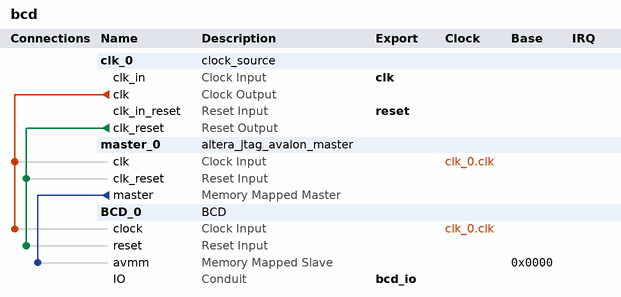
[diagram p0: system contents]
# Platform Designer (Qsys) system bcd, Cyclone II EP2C8Q208C8
# Parameters at their usual value, and those the tool derives, are not listed.
package require -exact qsys 13.0
create_system bcd
set_project_property DEVICE_FAMILY {Cyclone II}
set_project_property DEVICE EP2C8Q208C8

add_instance clk_0 clock_source 13.0
set_instance_parameter_value clk_0 clockFrequency 50000000

add_instance master_0 altera_jtag_avalon_master 13.0

add_instance BCD_0 BCD 1.0

# connections
add_connection clk_0.clk BCD_0.clock clock
add_connection clk_0.clk master_0.clk clock
add_connection clk_0.clk_reset BCD_0.reset reset
add_connection clk_0.clk_reset master_0.clk_reset reset
add_connection master_0.master BCD_0.avmm avalon
set_connection_parameter_value master_0.master/BCD_0.avmm baseAddress 0x0000

# exported interfaces
add_interface clk clock sink
set_interface_property clk EXPORT_OF clk_0.clk_in
add_interface reset reset sink
set_interface_property reset EXPORT_OF clk_0.clk_in_reset
add_interface bcd_io conduit end
set_interface_property bcd_io EXPORT_OF BCD_0.IO

set_interconnect_requirement {$system} qsys_mm.clockCrossingAdapter HANDSHAKE
set_interconnect_requirement {$system} qsys_mm.maxAdditionalLatency 1

save_system bcd.qsys
